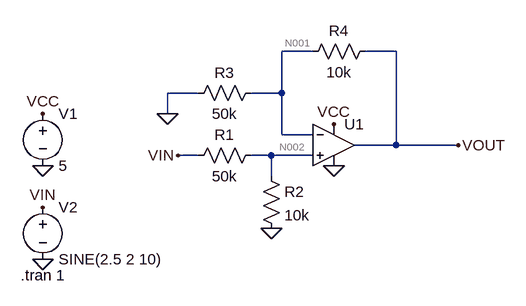
[diagram p0: schematic pressure_sensor_frontend.asc]
pressure_sensor_frontend.asc, the LTspice schematic file:
Version 4
SHEET 1 880 680
WIRE 544 0 496 0
WIRE 672 0 624 0
WIRE 368 64 320 64
WIRE 496 64 496 0
WIRE 496 64 448 64
WIRE 320 96 320 64
WIRE 496 128 496 64
WIRE 544 128 496 128
WIRE 672 144 672 0
WIRE 672 144 608 144
WIRE 768 144 672 144
WIRE 368 160 336 160
WIRE 480 160 448 160
WIRE 544 160 480 160
WIRE 480 192 480 160
FLAG 576 176 0
FLAG 128 176 0
FLAG 128 96 VCC
FLAG 576 112 VCC
FLAG 768 144 VOUT
FLAG 336 160 VIN
FLAG 128 320 0
FLAG 128 240 VIN
FLAG 480 272 0
FLAG 320 96 0
SYMBOL voltage 128 80 R0
WINDOW 123 0 0 Left 0
WINDOW 39 0 0 Left 0
SYMATTR InstName V1
SYMATTR Value 5
SYMBOL OpAmps\\UniversalOpamp2 576 144 R0
SYMATTR InstName U1
SYMBOL voltage 128 224 R0
WINDOW 123 0 0 Left 0
WINDOW 39 0 0 Left 0
SYMATTR InstName V2
SYMATTR Value SINE(2.5 2 10)
SYMBOL res 464 144 R90
WINDOW 0 0 56 VBottom 2
WINDOW 3 32 56 VTop 2
SYMATTR InstName R1
SYMATTR Value 50k
SYMBOL res 464 176 R0
SYMATTR InstName R2
SYMATTR Value 10k
SYMBOL res 464 48 R90
WINDOW 0 0 56 VBottom 2
WINDOW 3 32 56 VTop 2
SYMATTR InstName R3
SYMATTR Value 50k
SYMBOL res 640 -16 R90
WINDOW 0 0 56 VBottom 2
WINDOW 3 32 56 VTop 2
SYMATTR InstName R4
SYMATTR Value 10k
TEXT 94 344 Left 2 !.tran 1

The netlist it stands for:
* pressure_sensor_frontend.asc
V1 VCC 0 5
XU1 N002 N001 VCC 0 VOUT level.2 Avol=1Meg GBW=10Meg Slew=10Meg ilimit=25m rail=0 Vos=0 phimargin=45 en=0 enk=0 in=0 ink=0 Rin=500Meg  ; pins IN+ IN- V+ V- OUT
V2 VIN 0 SINE(2.5 2 10)
R1 N002 VIN 50k
R2 N002 0 10k
R3 N001 0 50k
R4 VOUT N001 10k
.tran 1
.lib UniversalOpamps2.sub
.backanno
.end

* Results of the author's LTspice run, read from the files saved beside the schematic
* Operating Point, zero values left out:
*   V(vcc) = 5 V
*   V(vout) = 500 mV
*   V(n001) = 416.7 mV
*   V(n002) = 416.7 mV
*   V(vin) = 2.5 V
*   I(R4) = 8.33 µA
*   I(R3) = 8.334 µA
*   I(R2) = 41.67 µA
*   I(R1) = -41.67 µA
*   I(V2) = -41.67 µA
*   I(V1) = -154.3 µA
*   Ix(u1:1) = -4.167 nA
*   Ix(u1:2) = -4.167 nA
*   Ix(u1:3) = 154.3 µA
*   Ix(u1:4) = -145.9 µA
*   Ix(u1:5) = -8.33 µA
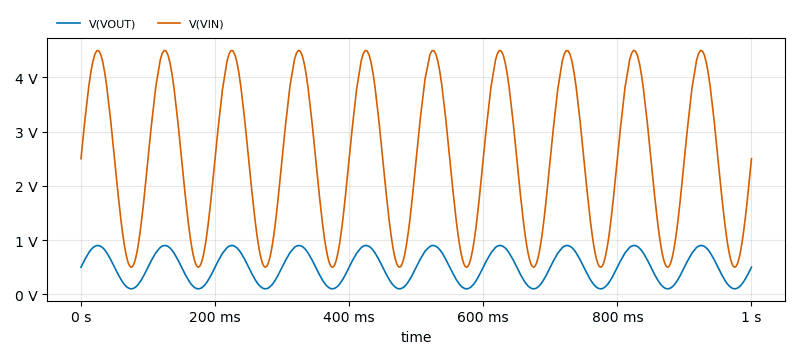
[diagram p1: Transient Analysis of pressure_sensor_frontend.asc, plotted from the saved traces]
* Transient Analysis, 1 run:
*   V(VOUT): min 100.4 mV, max 899.2 mV, average 499.3 mV, rms 574.3 mV, last 500 mV
*   V(VIN): min 500 mV, max 4.498 V, average 2.496 V, rms 2.872 V, last 2.5 V